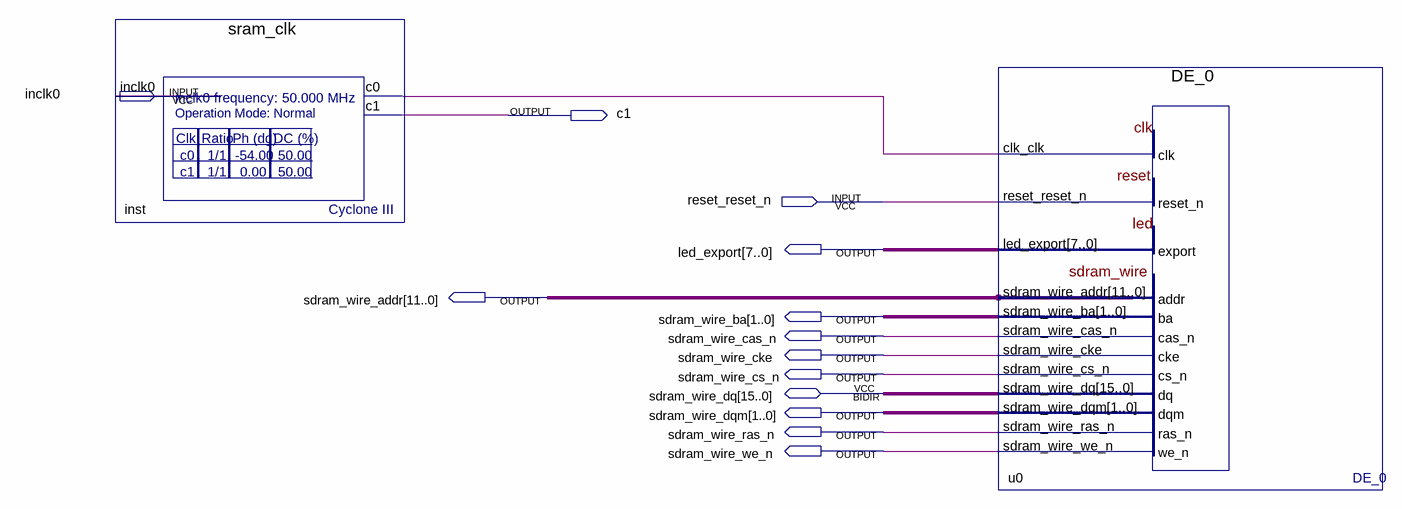
[diagram p0: schematic sheet]
// Quartus schematic sdram_DE0.bdf as structural Verilog: 2 symbols, 13 pins
module sdram_DE0 (
  input  inclk0,
  input  reset_reset_n,
  inout  [15:0] sdram_wire_dq,
  output c1,
  output [7:0] led_export,
  output [11:0] sdram_wire_addr,
  output [1:0] sdram_wire_ba,
  output sdram_wire_cas_n,
  output sdram_wire_cke,
  output sdram_wire_cs_n,
  output [1:0] sdram_wire_dqm,
  output sdram_wire_ras_n,
  output sdram_wire_we_n
);

  wire inst_c0;

  sram_clk inst (.inclk0(inclk0), .c0(inst_c0), .c1(c1));
  DE_0 u0 (
    .clk_clk(inst_c0), .reset_reset_n(reset_reset_n), .led_export(led_export),
    .sdram_wire_addr(sdram_wire_addr), .sdram_wire_ba(sdram_wire_ba), .sdram_wire_cas_n(sdram_wire_cas_n),
    .sdram_wire_cke(sdram_wire_cke), .sdram_wire_cs_n(sdram_wire_cs_n), .sdram_wire_dqm(sdram_wire_dqm),
    .sdram_wire_ras_n(sdram_wire_ras_n), .sdram_wire_we_n(sdram_wire_we_n), .sdram_wire_dq(sdram_wire_dq));
endmodule
